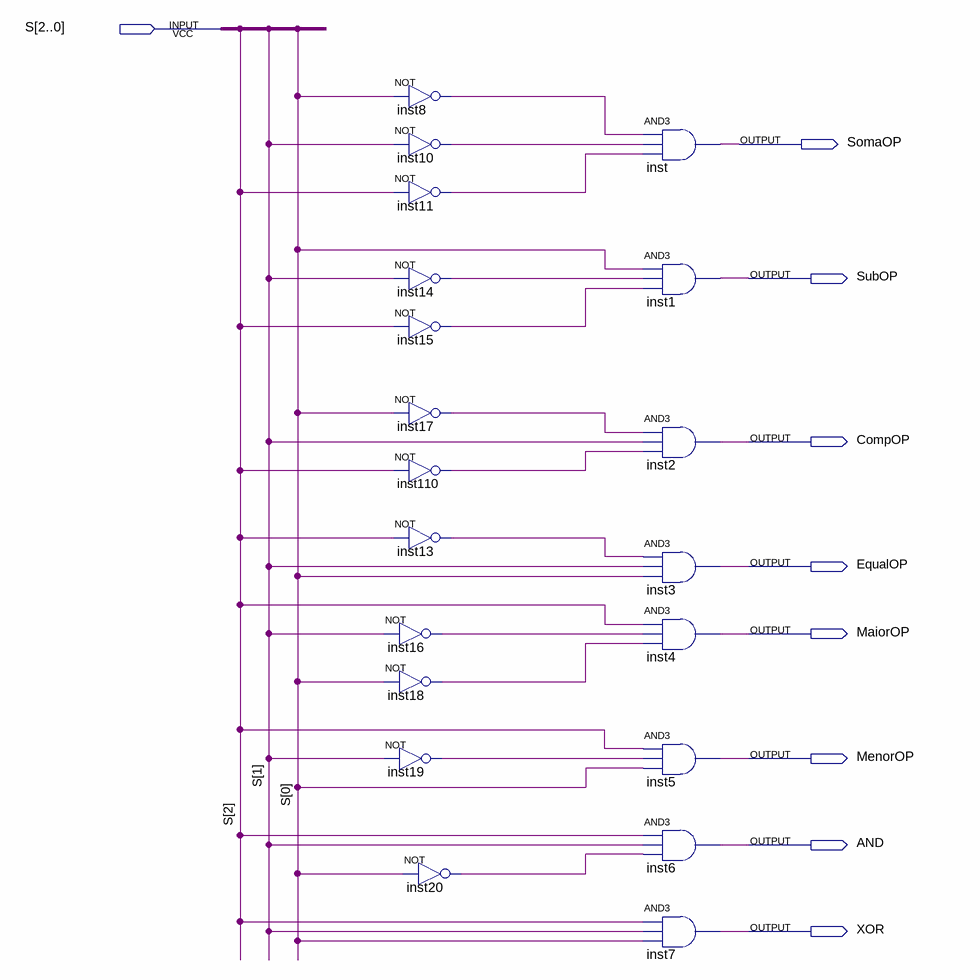
[diagram p0: schematic sheet]
// Quartus schematic Seletor_completo.bdf as structural Verilog: 20 symbols, 9 pins
module Seletor_completo (
  input  [2:0] S,
  output SomaOP,
  output SubOP,
  output CompOP,
  output EqualOP,
  output MaiorOP,
  output MenorOP,
  output AND,
  output XOR
);

  wire inst8_out, inst10_out, inst11_out, inst13_out, inst14_out, inst15_out, inst16_out, inst17_out,
       inst18_out, inst19_out, inst20_out, inst110_out;

  not inst8 (inst8_out, S[0]);
  not inst10 (inst10_out, S[1]);
  not inst11 (inst11_out, S[2]);
  not inst14 (inst14_out, S[1]);
  not inst15 (inst15_out, S[2]);
  not inst17 (inst17_out, S[0]);
  not inst110 (inst110_out, S[2]);
  not inst13 (inst13_out, S[2]);
  not inst16 (inst16_out, S[1]);
  not inst18 (inst18_out, S[0]);
  not inst19 (inst19_out, S[1]);
  not inst20 (inst20_out, S[0]);
  and inst (SomaOP, inst8_out, inst10_out, inst11_out);
  and inst1 (SubOP, S[0], inst14_out, inst15_out);
  and inst2 (CompOP, inst17_out, S[1], inst110_out);
  and inst3 (EqualOP, inst13_out, S[1], S[0]);
  and inst4 (MaiorOP, S[2], inst16_out, inst18_out);
  and inst5 (MenorOP, S[2], inst19_out, S[0]);
  and inst6 (AND, S[2], S[1], inst20_out);
  and inst7 (XOR, S[2], S[1], S[0]);
endmodule
